# EAGLE board 8_bit_Left_Rev_A (EAGLE 9.6.0)
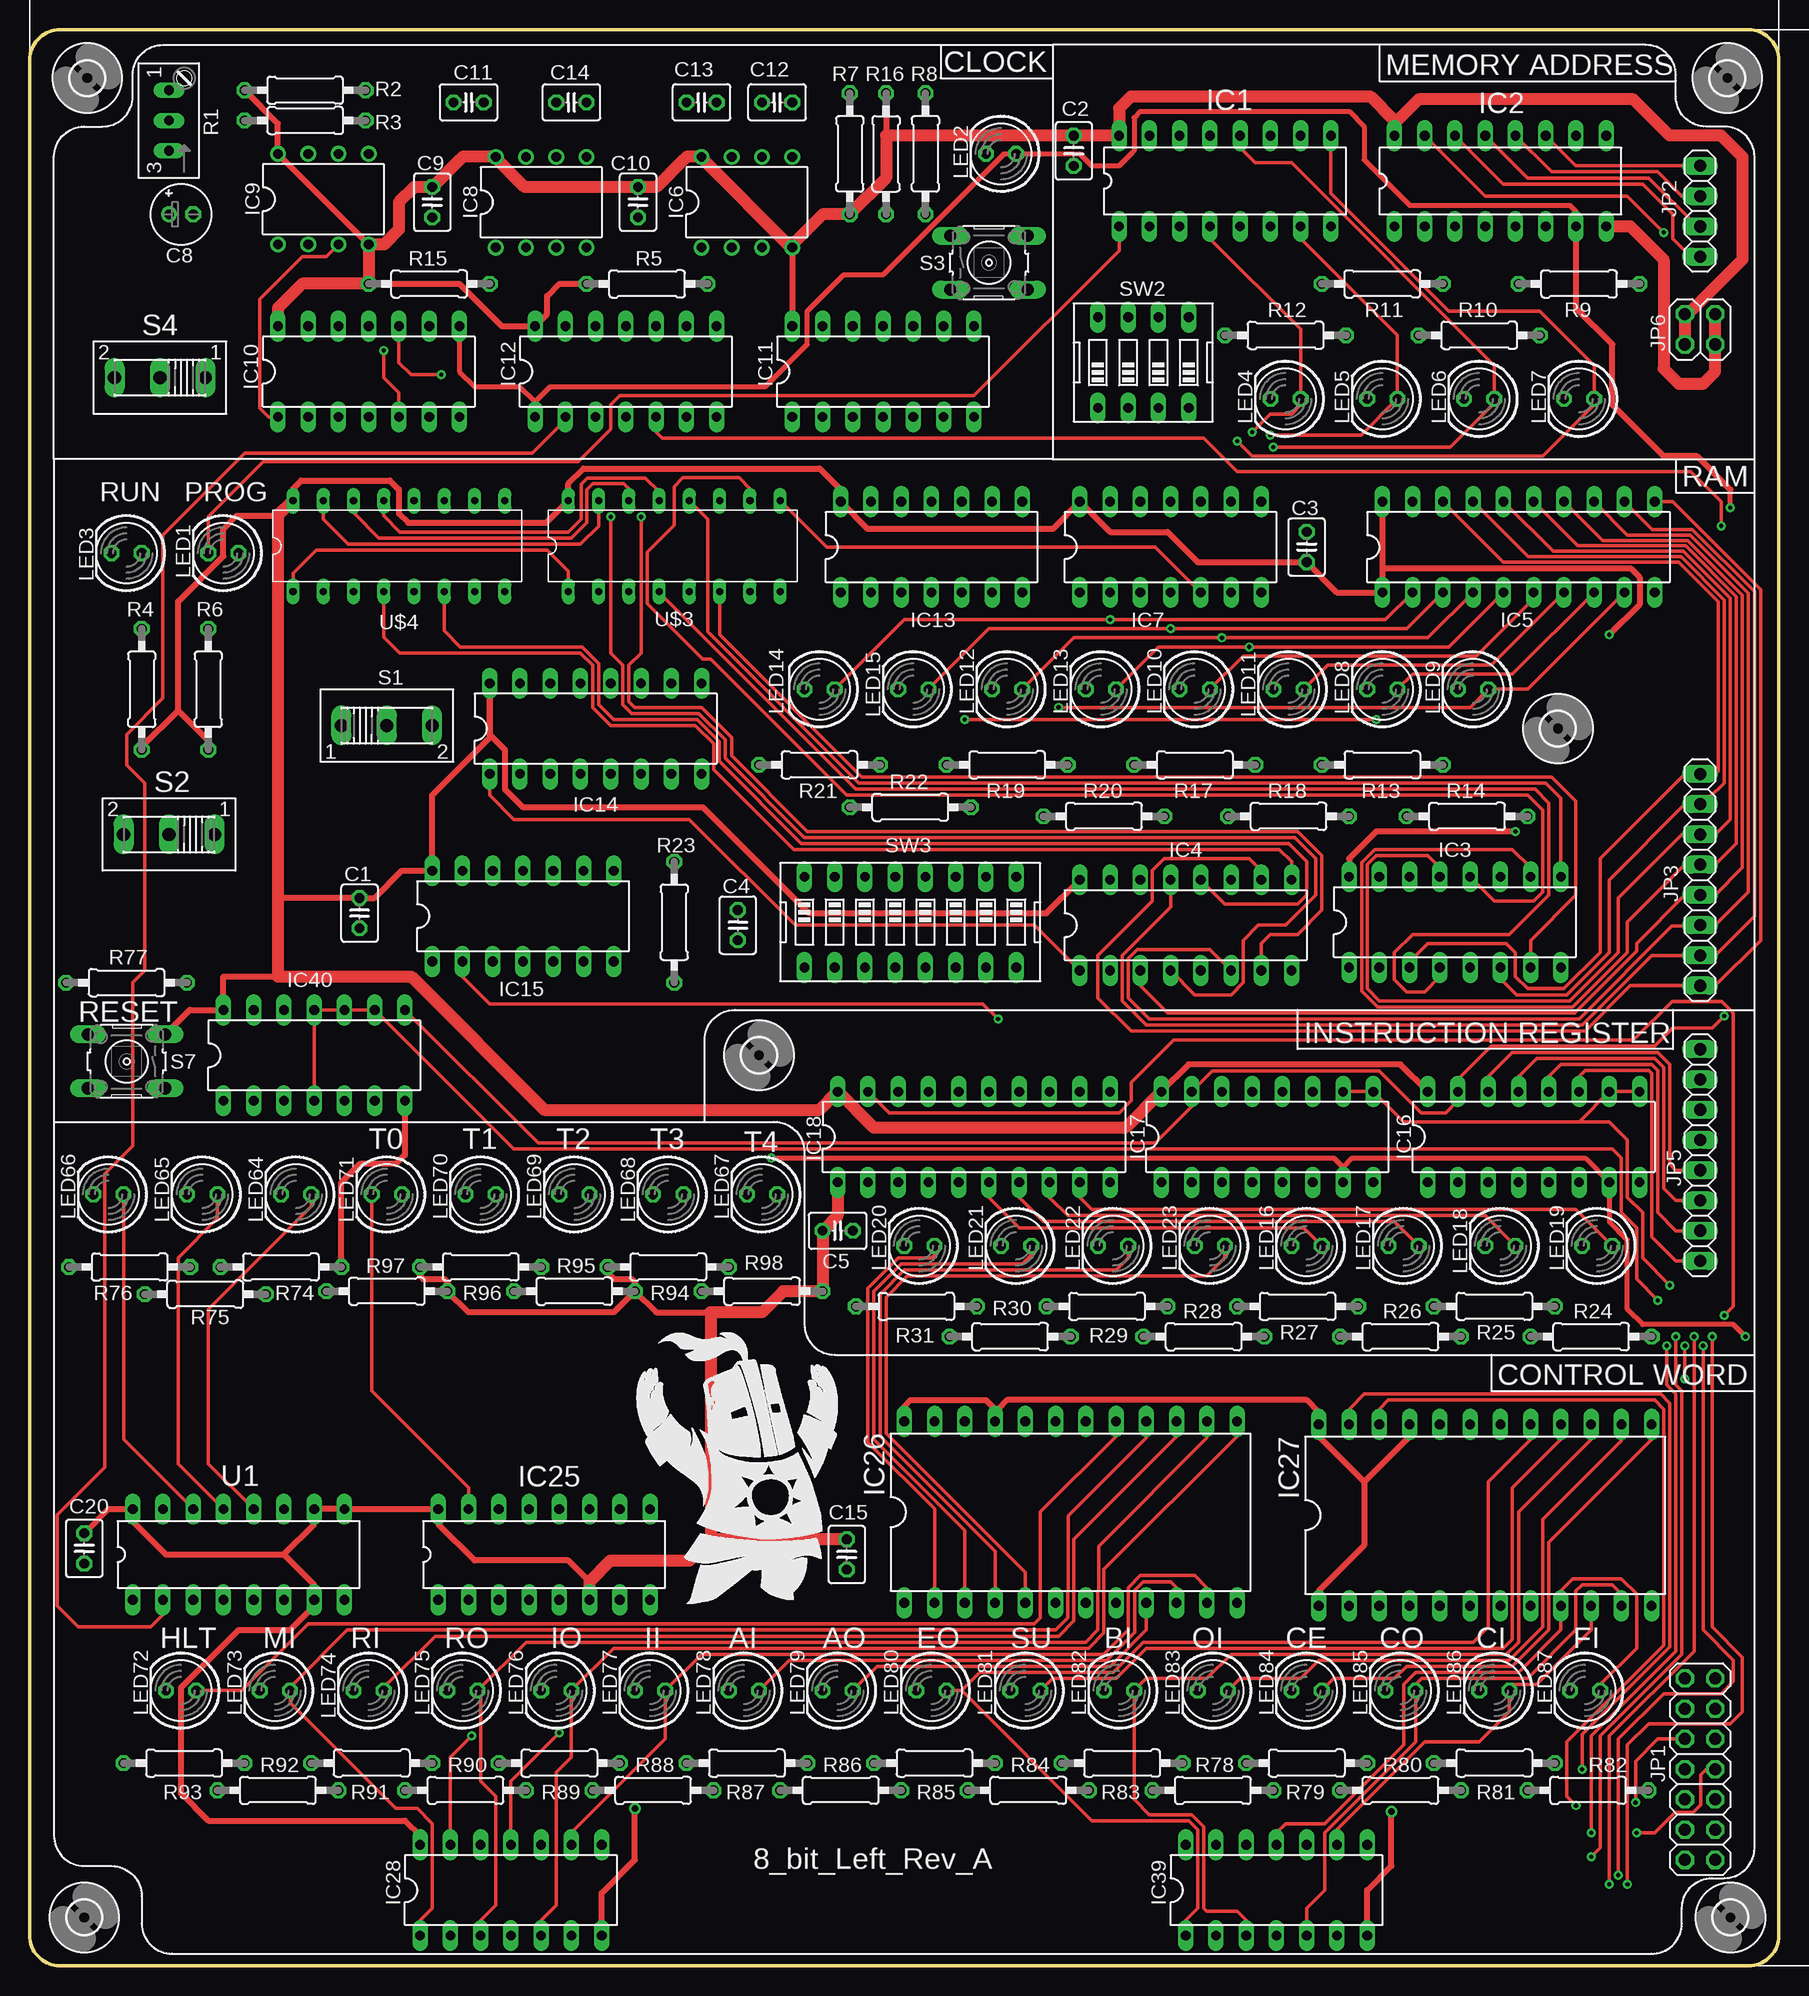
[diagram p6: board, top side]
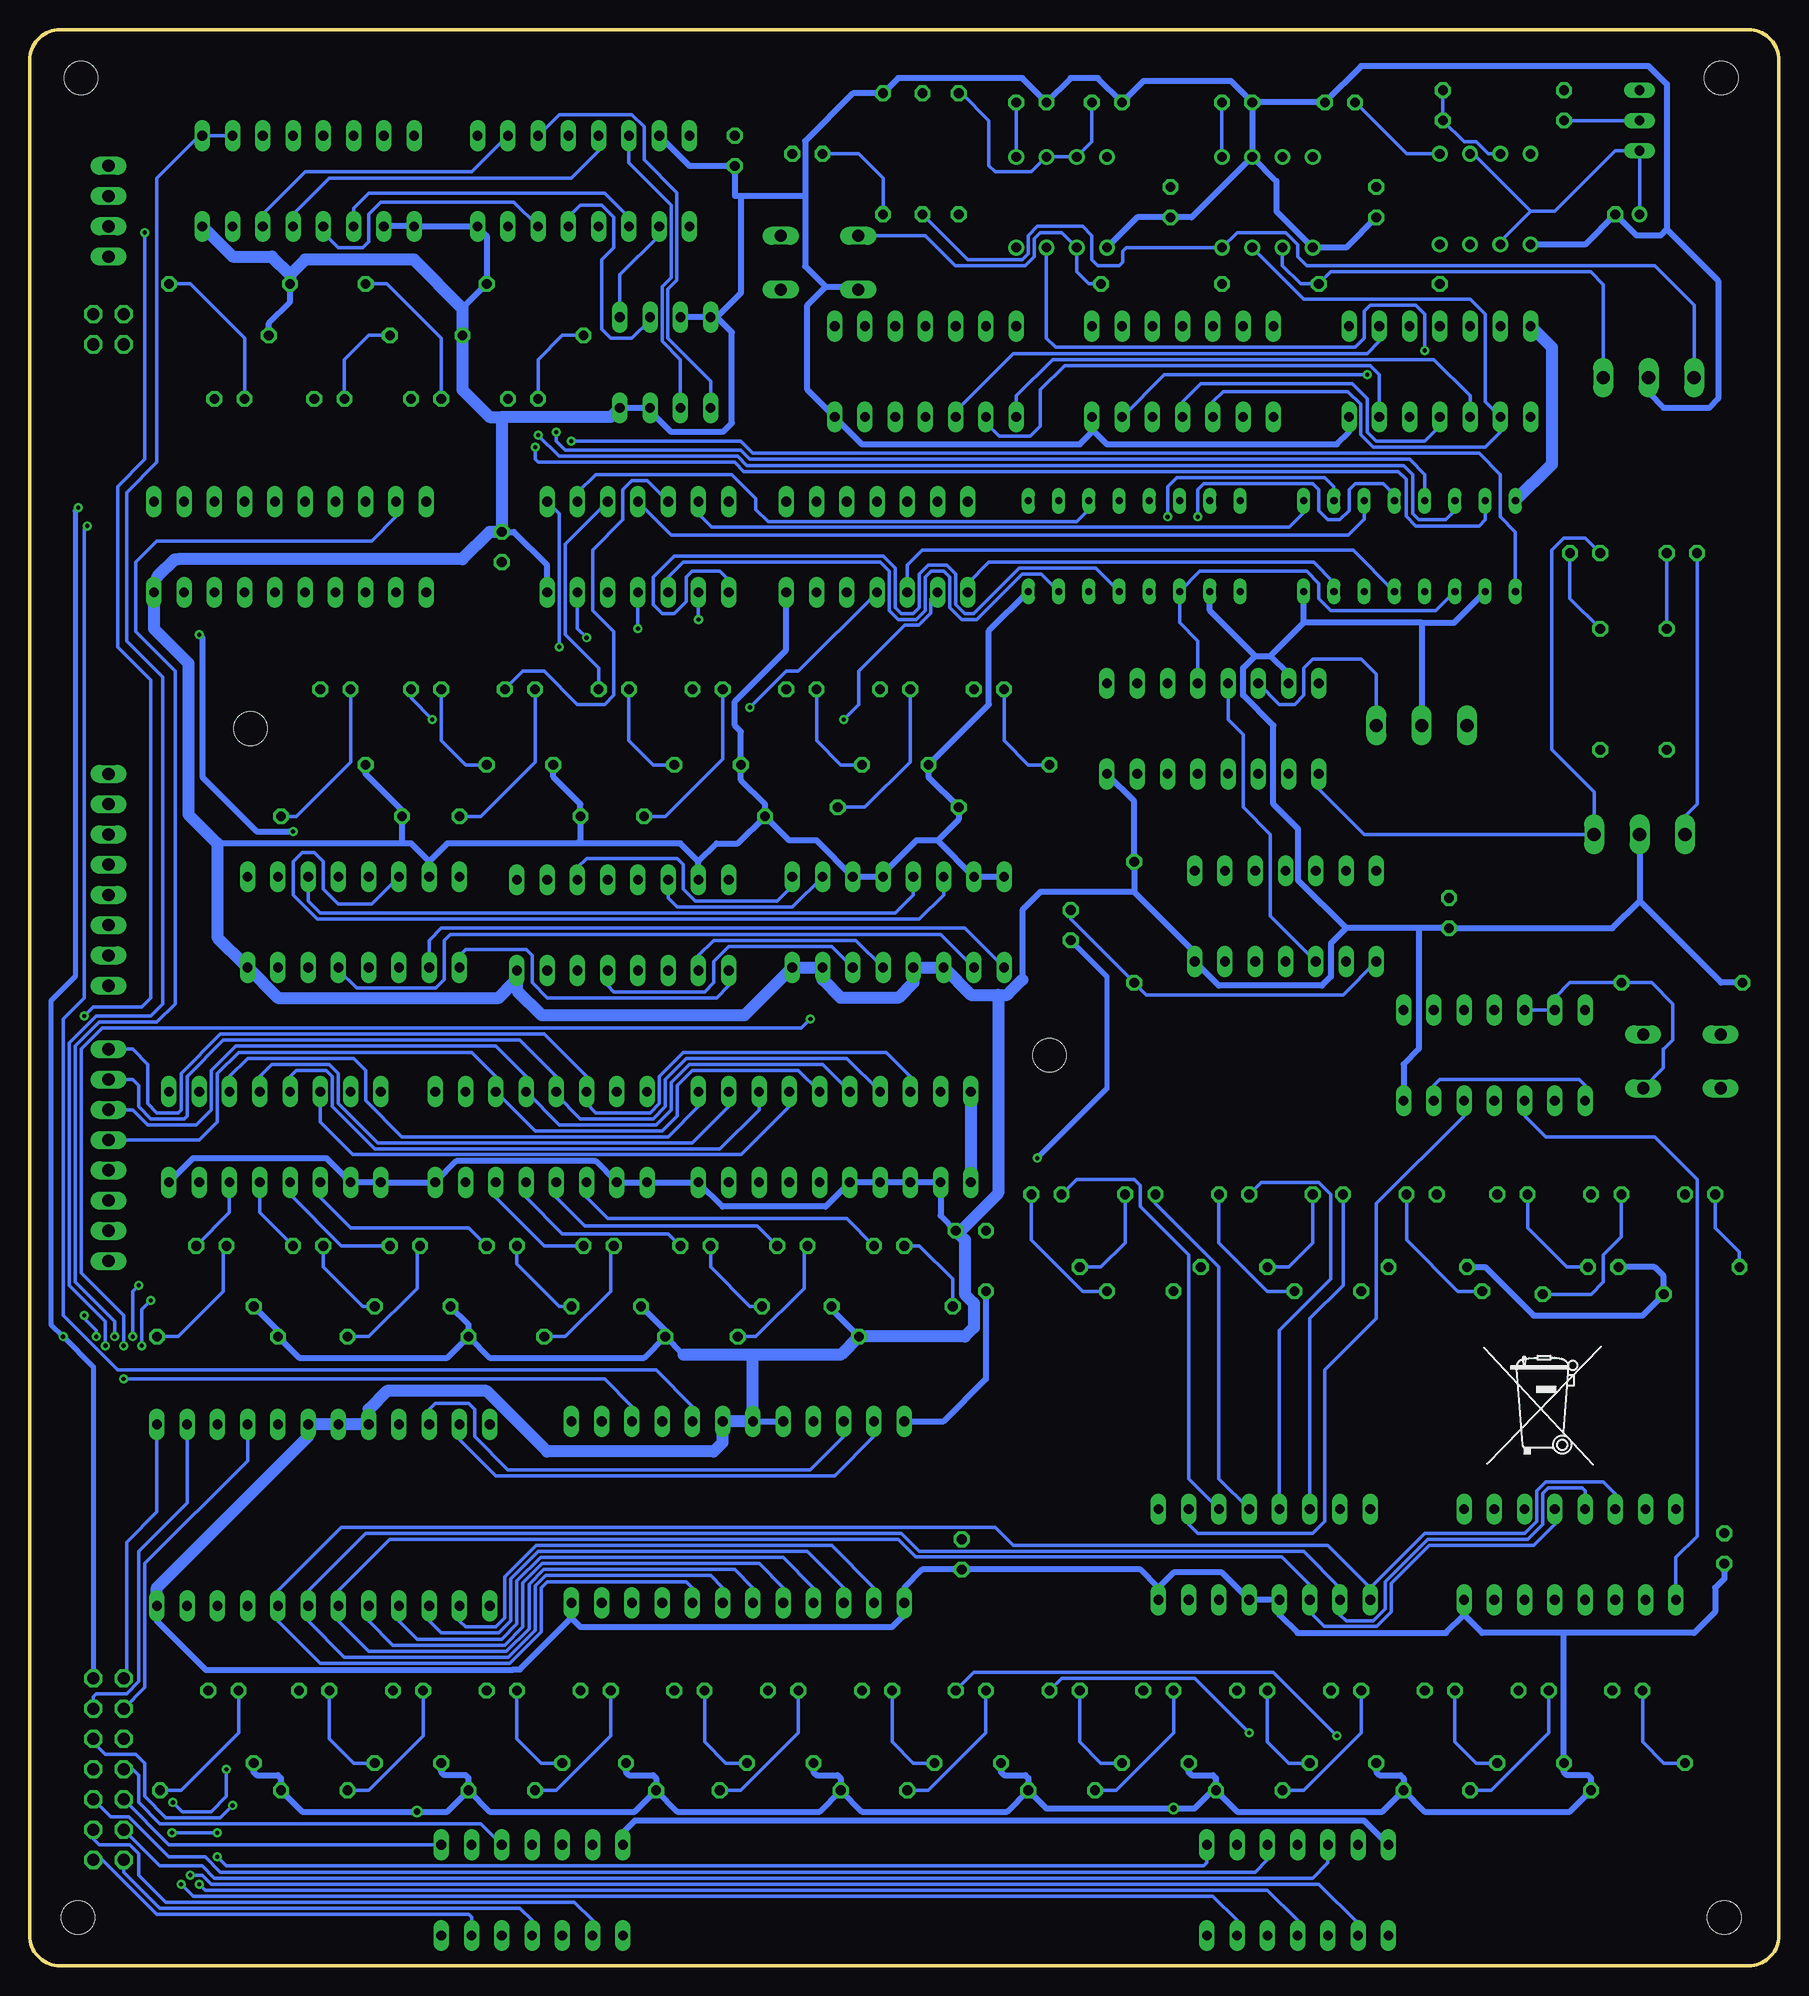
[diagram p7: board, bottom side, seen from below]

Size 146.81 x 162.56 mm. Coordinates in mm from the lower left corner, seen from the top.
Outline: 144.27,162.56 2.54,162.56 arc90 0,160.02 0,2.54 arc90 2.54,0 144.27,0 arc90 146.81,2.54 146.81,160.02 arc90 144.27,162.56
Copper layers (1*16): Top 0.035mm / dielectric 1.5mm / Bottom 0.035mm
Design rules "default": minimum track width 6mil, minimum drill 0.35mm, track to track 6mil, track to pad 6mil, pad to pad 6mil, via to via 6mil, smd to smd 6mil, copper to edge 40mil, drill to drill 6mil, minimum pad ring 10mil, minimum via ring 8mil, stop-mask expansion 4mil, vias tented up to drill 0mil, thermal gap 10mil
Net classes: 1 zasilanie: width 0.508 mm

## Footprints (pad centres in the part's own frame; a part is rotated, then mirrored left to right if it is on the bottom)
C025-030X050 = drill 0.813 octagon: 1 -1.27,0; 2 1.27,0
E2-5 = drill 0.813 pad 1.27: + -1.016,0 | drill 0.813 pad 1.27 octagon: - 1.016,0
2,8 = hole 2.8: 0,0
DIL16 = drill 0.813 long: 1 -8.89,-3.81; 2 -6.35,-3.81; 3 -3.81,-3.81; 4 -1.27,-3.81; 5 1.27,-3.81; 6 3.81,-3.81; 7 6.35,-3.81; 8 8.89,-3.81; 9 8.89,3.81; 10 6.35,3.81; 11 3.81,3.81; 12 1.27,3.81; 13 -1.27,3.81; 14 -3.81,3.81; 15 -6.35,3.81; 16 -8.89,3.81
DIL20 = drill 0.813 long: 1 -11.43,-3.81; 2 -8.89,-3.81; 3 -6.35,-3.81; 4 -3.81,-3.81; 5 -1.27,-3.81; 6 1.27,-3.81; 7 3.81,-3.81; 8 6.35,-3.81; 9 8.89,-3.81; 10 11.43,-3.81; 11 11.43,3.81; 12 8.89,3.81; 13 6.35,3.81; 14 3.81,3.81; 15 1.27,3.81; 16 -1.27,3.81; 17 -3.81,3.81; 18 -6.35,3.81; 19 -8.89,3.81; 20 -11.43,3.81
DIL08 = drill 0.813 pad 1.27: 1 -3.81,-3.81; 2 -1.27,-3.81; 3 1.27,-3.81; 4 3.81,-3.81; 5 3.81,3.81; 6 1.27,3.81; 7 -1.27,3.81; 8 -3.81,3.81
DIL14 = drill 0.813 long: 1 -7.62,-3.81; 2 -5.08,-3.81; 3 -2.54,-3.81; 4 0,-3.81; 5 2.54,-3.81; 6 5.08,-3.81; 7 7.62,-3.81; 8 7.62,3.81; 9 5.08,3.81; 10 2.54,3.81; 11 0,3.81; 12 -2.54,3.81; 13 -5.08,3.81; 14 -7.62,3.81
DIL24-6 = drill 0.813 long: 1 -13.97,-7.62; 2 -11.43,-7.62; 3 -8.89,-7.62; 4 -6.35,-7.62; 5 -3.81,-7.62; 6 -1.27,-7.62; 7 1.27,-7.62; 8 3.81,-7.62; 9 6.35,-7.62; 10 8.89,-7.62; 11 11.43,-7.62; 12 13.97,-7.62; 13 13.97,7.62; 14 11.43,7.62; 15 8.89,7.62; 16 6.35,7.62; 17 3.81,7.62; 18 1.27,7.62; 19 -1.27,7.62; 20 -3.81,7.62; 21 -6.35,7.62; 22 -8.89,7.62; 23 -11.43,7.62; 24 -13.97,7.62
2X07 = drill 1.016 octagon: 1 -7.62,-1.27; 2 -7.62,1.27; 3 -5.08,-1.27; 4 -5.08,1.27; 5 -2.54,-1.27; 6 -2.54,1.27; 7 0,-1.27; 8 0,1.27; 9 2.54,-1.27; 10 2.54,1.27; 11 5.08,-1.27; 12 5.08,1.27; 13 7.62,-1.27; 14 7.62,1.27
1X04 = drill 1.016 long: 1 -3.81,0; 2 -1.27,0; 3 1.27,0; 4 3.81,0
1X08 = drill 1.016 long: 1 -8.89,0; 2 -6.35,0; 3 -3.81,0; 4 -1.27,0; 5 1.27,0; 6 3.81,0; 7 6.35,0; 8 8.89,0
2X02 = drill 1.016 octagon: 1 -1.27,-1.27; 2 -1.27,1.27; 3 1.27,-1.27; 4 1.27,1.27
LED5MM = drill 0.813 octagon: A -1.27,0; K 1.27,0
S64W = drill 0.813 long: A 2.54,1.27; E -2.54,1.27; S 0,1.27
0207/10 = drill 0.813 octagon: 1 -5.08,0; 2 5.08,0
255SB = drill 1.118 long: 1 -3.81,0; 2 0,0; 3 3.81,0
B3F-10XX = drill 1.016 long: 1 -3.251,2.261; 2 3.251,2.261; 3 -3.251,-2.261; 4 3.251,-2.261
EDG-04 = drill 0.813 long: 1 -3.81,-3.81; 2 -1.27,-3.81; 3 1.27,-3.81; 4 3.81,-3.81; 5 3.81,3.81; 6 1.27,3.81; 7 -1.27,3.81; 8 -3.81,3.81
EDG-08 = drill 0.813 long: 1 -8.89,-3.81; 2 -6.35,-3.81; 3 -3.81,-3.81; 4 -1.27,-3.81; 5 1.27,-3.81; 6 3.81,-3.81; 7 6.35,-3.81; 8 8.89,-3.81; 9 8.89,3.81; 10 6.35,3.81; 11 3.81,3.81; 12 1.27,3.81; 13 -1.27,3.81; 14 -3.81,3.81; 15 -6.35,3.81; 16 -8.89,3.81
74LS189 = drill 0.6 long: 1 0,0.08; 2 2.54,0.08; 3 5.08,0.08; 4 7.62,0.08; 5 10.16,0.08; 6 12.7,0.08; 7 15.24,0.08; 8 17.78,0.08; 9 17.78,7.7; 10 15.24,7.7; 11 12.7,7.7; 12 10.16,7.7; 13 7.62,7.7; 14 5.08,7.7; 15 2.54,7.7; 16 0,7.7

## Placement (x,y rotation side)
C1  0,1uF  [C025-030X050]  27.69,88.39 270 top
C2  0,1uF  [C025-030X050]  87.63,152.4 270 top
C3  0,1uF  [C025-030X050]  107.19,119.13 90 top
C4  0,01uF  [C025-030X050]  59.44,87.38 90 top
C5  0,1uF  [C025-030X050]  67.82,61.72 0 top
C8  1uF  [E2-5]  12.7,147.07 0 top
C9  0,1uF  [C025-030X050]  33.78,148.08 270 top
C10  0,1uF  [C025-030X050]  51.05,148.08 270 top
C11  0,01uF  [C025-030X050]  36.83,156.46 0 top
C12  0,01uF  [C025-030X050]  62.74,156.46 180 top
C13  0,1uF  [C025-030X050]  56.39,156.46 180 top
C14  0,01uF  [C025-030X050]  45.47,156.46 180 top
C15  0,1uF  [C025-030X050]  68.58,34.54 270 top
C20  0,1uF  [C025-030X050]  4.57,35.05 270 top
H1  MOUNT-HOLE2.8  [2,8]  4.57,4.06 0 top
H2  MOUNT-HOLE2.8  [2,8]  4.83,158.5 0 top
H3  MOUNT-HOLE2.8  [2,8]  142.49,158.5 0 top
H4  MOUNT-HOLE2.8  [2,8]  142.75,4.06 0 top
H5  MOUNT-HOLE2.8  [2,8]  61.21,76.45 0 top
H6  MOUNT-HOLE2.8  [2,8]  128.27,103.89 0 top
IC1  74LS157N  [DIL16]  100.33,149.86 0 top
IC2  74LS173N  [DIL16]  123.44,149.86 0 top
IC3  74157N  [DIL16]  119.63,87.63 0 top
IC4  74157N  [DIL16]  97.03,87.38 0 top
IC5  74LS245N  [DIL20]  124.97,119.13 0 top
IC6  LM555N  [DIL08]  60.2,148.08 0 top
IC7  7404N  [DIL14]  95.76,119.13 0 top
IC8  LM555N  [DIL08]  42.93,148.08 0 top
IC9  LM555N  [DIL08]  24.64,148.34 0 top
IC10  74LS08N  [DIL14]  28.45,133.86 0 top
IC11  74LS32N  [DIL14]  71.63,133.86 0 top
IC12  74LS04N  [DIL14]  50.04,133.86 0 top
IC13  7404N  [DIL14]  75.69,119.13 0 top
IC14  74157N  [DIL16]  47.5,103.89 0 top
IC15  7400N  [DIL14]  41.4,88.14 0 top
IC16  74LS173N  [DIL16]  126.24,69.6 0 top
IC17  74LS173N  [DIL16]  103.89,69.6 0 top
IC18  74LS245N  [DIL20]  79.25,69.6 0 top
IC25  74LS138N  [DIL16]  43.18,34.54 0 top
IC26  28C16AP  [DIL24-6]  87.38,38.1 0 top
IC27  28C16AP  [DIL24-6]  122.17,37.85 0 top
IC28  7404N  [DIL14]  40.39,6.35 0 top
IC39  7404N  [DIL14]  104.65,6.35 0 top
IC40  7400N  [DIL14]  23.88,76.45 0 top
JP1  [2X07]  140.21,16.51 270 top
JP2  [1X04]  140.21,147.32 270 top
JP3  [1X08]  140.21,91.19 90 top
JP5  [1X08]  140.21,68.07 90 top
JP6  [2X02]  140.21,137.41 0 top
LED1  RED  [LED5MM]  16.26,118.62 180 top
LED2  BLUE  [LED5MM]  81.53,152.15 180 top
LED3  GREEN  [LED5MM]  8.13,118.62 180 top
LED4  YELLOW  [LED5MM]  105.41,131.57 180 top
LED5  YELLOW  [LED5MM]  113.54,131.57 180 top
LED6  YELLOW  [LED5MM]  121.67,131.57 180 top
LED7  YELLOW  [LED5MM]  130.05,131.57 180 top
LED8  RED  [LED5MM]  113.54,107.19 180 top
LED9  RED  [LED5MM]  121.16,107.19 180 top
LED10  RED  [LED5MM]  97.79,107.19 180 top
LED11  RED  [LED5MM]  105.66,107.19 180 top
LED12  RED  [LED5MM]  82.04,107.19 180 top
LED13  RED  [LED5MM]  89.92,107.19 180 top
LED14  RED  [LED5MM]  66.29,107.19 180 top
LED15  RED  [LED5MM]  74.17,107.19 180 top
LED16  YELLOW  [LED5MM]  107.19,60.45 180 top
LED17  YELLOW  [LED5MM]  115.32,60.45 180 top
LED18  YELLOW  [LED5MM]  123.44,60.45 180 top
LED19  YELLOW  [LED5MM]  131.57,60.45 180 top
LED20  BLUE  [LED5MM]  74.68,60.45 180 top
LED21  BLUE  [LED5MM]  82.8,60.45 180 top
LED22  BLUE  [LED5MM]  90.93,60.45 180 top
LED23  BLUE  [LED5MM]  99.06,60.45 180 top
LED64  RED  [LED5MM]  22.35,64.77 180 top
LED65  RED  [LED5MM]  14.48,64.77 180 top
LED66  RED  [LED5MM]  6.6,64.77 180 top
LED67  GREEN  [LED5MM]  61.47,64.77 180 top
LED68  GREEN  [LED5MM]  53.59,64.77 180 top
LED69  GREEN  [LED5MM]  45.72,64.77 180 top
LED70  GREEN  [LED5MM]  37.85,64.77 180 top
LED71  GREEN  [LED5MM]  29.97,64.77 180 top
LED72  BLUE  [LED5MM]  12.7,23.11 180 top
LED73  BLUE  [LED5MM]  20.57,23.11 180 top
LED74  BLUE  [LED5MM]  28.45,23.11 180 top
LED75  BLUE  [LED5MM]  36.32,23.11 180 top
LED76  BLUE  [LED5MM]  44.2,23.11 180 top
LED77  BLUE  [LED5MM]  52.07,23.11 180 top
LED78  BLUE  [LED5MM]  59.94,23.11 180 top
LED79  BLUE  [LED5MM]  67.82,23.11 180 top
LED80  BLUE  [LED5MM]  75.69,23.11 180 top
LED81  BLUE  [LED5MM]  83.57,23.11 180 top
LED82  BLUE  [LED5MM]  91.44,23.11 180 top
LED83  BLUE  [LED5MM]  99.31,23.11 180 top
LED84  BLUE  [LED5MM]  107.19,23.11 180 top
LED85  BLUE  [LED5MM]  115.06,23.11 180 top
LED86  BLUE  [LED5MM]  122.94,23.11 180 top
LED87  BLUE  [LED5MM]  130.56,23.11 180 top
R1  1M  [S64W]  12.95,154.94 90 top
R2  1k  [0207/10]  23.11,157.48 180 top
R3  1k  [0207/10]  23.11,154.94 180 top
R4  1k  [0207/10]  9.4,107.19 90 top
R5  1k  [0207/10]  51.82,141.22 0 top
R6  1k  [0207/10]  14.99,107.19 90 top
R7  1M  [0207/10]  68.83,152.15 90 top
R8  1k  [0207/10]  71.88,152.15 270 top
R9  220  [0207/10]  130.05,141.22 0 top
R10  220  [0207/10]  121.67,136.91 180 top
R11  220  [0207/10]  113.54,141.22 0 top
R12  220  [0207/10]  105.41,136.91 180 top
R13  220  [0207/10]  113.54,100.84 180 top
R14  220  [0207/10]  120.65,96.52 0 top
R15  1k  [0207/10]  33.53,141.22 0 top
R16  220  [0207/10]  75.18,152.15 90 top
R17  220  [0207/10]  97.79,100.84 180 top
R18  220  [0207/10]  105.66,96.52 0 top
R19  220  [0207/10]  82.04,100.84 180 top
R20  220  [0207/10]  90.17,96.52 0 top
R21  220  [0207/10]  66.29,100.84 180 top
R22  220  [0207/10]  73.91,97.28 0 top
R23  1k  [0207/10]  54.1,87.63 270 top
R24  220  [0207/10]  131.06,52.83 0 top
R25  220  [0207/10]  122.94,55.37 180 top
R26  220  [0207/10]  115.06,52.83 0 top
R27  220  [0207/10]  106.43,55.37 180 top
R28  220  [0207/10]  98.55,52.83 0 top
R29  220  [0207/10]  90.42,55.37 180 top
R30  220  [0207/10]  82.3,52.83 0 top
R31  220  [0207/10]  74.42,55.37 180 top
R74  220  [0207/10]  21.08,58.67 180 top
R75  220  [0207/10]  14.73,56.39 0 top
R76  220  [0207/10]  8.38,58.67 180 top
R77  1k  [0207/10]  8.13,82.55 180 top
R78  220  [0207/10]  99.31,14.73 0 top
R79  220  [0207/10]  107.19,17.02 180 top
R80  220  [0207/10]  115.06,14.73 0 top
R81  220  [0207/10]  122.94,17.02 180 top
R82  220  [0207/10]  130.81,14.73 0 top
R83  220  [0207/10]  91.69,17.02 180 top
R84  220  [0207/10]  83.82,14.73 0 top
R85  220  [0207/10]  75.95,17.02 180 top
R86  220  [0207/10]  68.07,14.73 0 top
R87  220  [0207/10]  60.2,17.02 180 top
R88  220  [0207/10]  52.32,14.73 0 top
R89  220  [0207/10]  44.45,17.02 180 top
R90  220  [0207/10]  36.58,14.73 0 top
R91  220  [0207/10]  28.7,17.02 180 top
R92  220  [0207/10]  20.83,14.73 0 top
R93  220  [0207/10]  12.95,17.02 180 top
R94  220  [0207/10]  53.59,58.67 180 top
R95  220  [0207/10]  45.72,56.64 0 top
R96  220  [0207/10]  37.85,58.67 180 top
R97  220  [0207/10]  29.97,56.64 0 top
R98  220  [0207/10]  61.47,56.64 0 top
S1  5 mm  [255SB]  29.97,104.14 0 top
S2  5 mm  [255SB]  11.68,95 180 top
S3  5mm  [B3F-10XX]  80.52,143 0 top
S4  5 mm  [255SB]  10.92,133.35 180 top
S7  RESET  [B3F-10XX]  8.13,75.95 180 top
SW2  [EDG-04]  93.47,134.62 0 top
SW3  [EDG-08]  73.91,87.63 180 top
U1  74LS161N  [DIL16]  17.53,34.54 0 top
U$1  [MUELLTONNE_10.00]  25.4,41.66 0 bottom
U$2  [SOLAIRE]  47.5,28.19 0 top
U$3  74LS189A  [74LS189]  45.21,115.32 0 top
U$4  74LS189A  [74LS189]  22.1,115.32 0 top

## Tracks (layer width: path | path; a pad name or v marks a point on that pad's centre or on a via)
A0  (via drill 0.35)
  Top 0.305: IC1.9 109.22,148.84 119.13,138.94 126.75,138.94 131.32,134.37 LED7.A 131.32,131.06 127,126.75 102.62,126.75 v101.35,128.02 | U$4.1 22.1,116.92 24.05,118.87 43.43,118.87 45.21,117.09 U$3.1
  Bottom 0.305: U$4.1 22.1,120.4 23.37,121.67 23.37,125.22 25.15,127 86.11,127 87.12,128.02 v101.35,128.02
A1  (via drill 0.35)
  Top 0.305: IC1.12 101.6,152.65 102.87,151.38 105.92,151.38 122.94,134.37 LED6.A 122.94,131.22 119.22,127.51 v104.37,127.51 | U$4.15 24.64,121.49 26.75,119.38 46.23,119.38 47.75,120.9 U$3.15
  Bottom 0.305: U$4.15 24.64,121.41 25.15,120.9 30.48,120.9 31.29,121.71 31.29,124.83 31.93,125.48 86.87,125.48 87.64,126.25 104.13,126.25 104.37,126.49 v104.37,127.51
A2  (via drill 0.35)
  Top 0.305: IC1.7 106.68,145.03 114.81,136.91 LED5.A 111.76,128.52 v104.12,128.52 | U$4.14 27.18,122 29.29,119.89 45.47,119.89 46.74,121.16 46.74,123.95 47.24,124.46 49.86,124.46 50.29,124.03 U$3.14
  Bottom 0.305: U$4.14 27.18,122.17 27.94,121.41 30.23,121.41 30.73,121.92 30.73,125.22 31.5,125.98 86.61,125.98 87.38,126.75 102.36,126.75 104.12,128.5 v104.12,128.52
A3  (via drill 0.35)
  Top 0.305: IC1.4 99.06,145.03 106.68,137.41 LED4.A 106.68,131.06 105.92,130.3 104.14,130.3 v102.62,128.78 | U$4.13 29.72,121.75 31.07,120.4 45.21,120.4 46.28,121.46 46.28,124.39 46.8,124.92 51.68,124.92 52.83,123.77 U$3.13
  Bottom 0.305: U$4.13 29.72,125.22 30.99,126.49 86.36,126.49 87.12,127.25 101.85,127.25 102.62,128.02 v102.62,128.78
ASD1
  Bottom 0.305: IC25.10 49.53,37.08 48.77,36.32 39.12,36.32 38.1,37.34 38.1,50.04 33.78,54.36 33.78,64.01 26.42,71.37 IC40.5
CE
  Top 0.305: LED84.A 109.47,24.13 114.55,24.13 115.57,25.15 124.46,25.15 127.51,28.19 127.51,35.56 136.14,44.2 IC27.13
  Bottom 0.305: IC27.13 136.14,38.1 138.68,35.56 138.68,24.38 JP1.1
CF  (via drill 0.35)
  Top 0.305: IC27.23 110.74,46.74 112.01,48.01 136.91,48.01 137.67,47.24 137.67,26.79 130.3,19.42 v130.3,16.51 | v134.79,13.72 134.79,17.19 136.65,19.05 JP1.5
  Bottom 0.305: IC27.23 110.74,44.2 107.7,41.15 79.25,41.15 75.95,44.45 IC26.23 | v130.3,16.51 130.3,14.22 131.57,12.95 134.03,12.95 v134.79,13.72
CLK  (via drill 0.35)
  Top 0.305: 92.58,152.27 92.71,152.4
  Top 0.406: IC10.8 36.07,133.86 37.34,132.59 41.15,132.59 42.42,131.32 | IC12.1 42.42,131.32 | 42.42,131.32 43.69,132.59 61.72,132.59 65.28,136.14 65.28,138.94 68.33,141.99 71.63,141.99 81.79,152.15 LED2.A 88.14,152.15 89.15,151.13 91.44,151.13 92.58,152.27 | 92.71,152.4 92.71,155.19 93.22,155.7 110.74,155.7 112.01,154.43 112.01,151.64 115.82,147.83 129.29,147.83 129.79,147.32 IC2.7 | v62.23,67.82 109.47,67.82 110.24,67.06 | IC17.7 110.24,67.06 | 110.24,67.06 111,67.82 130.56,67.82 IC16.7 132.59,62.48 134.11,60.96 134.11,55.12 135.38,53.85 143,53.85 v144.02,52.83 | v142.75,122.43 142.75,123.95
  Top 0.508: 142.75,123.95 139.95,126.75 137.16,126.75 132.84,131.06 132.84,136.14 129.79,139.19 IC2.7
  Bottom 0.406: C4.1 56.39,83.06 56.39,73.66 v62.23,67.82 | v142.75,122.43 143,122.17 143,83.06 145.03,81.03 145.03,53.85 v144.02,52.83 141.48,50.29 JP1.2
CLK4
  Top 0.305: U1.14 7.87,44.2 LED66.A
  Bottom 0.305: IC26.8 91.19,31.75 91.69,32.26 103.38,32.26 103.89,31.75 103.89,28.03 106.52,25.4 122.43,25.4 125.98,28.96 IC27.8 125.98,31.5 120.65,36.83 65.79,36.83 64.26,35.31 37.85,35.31 34.29,31.75 | IC25.1 34.29,31.75 | U1.14 13.72,39.62 14.73,40.64 19.56,40.64 20.32,39.88 20.32,37.34 21.34,36.32 29.72,36.32 34.29,31.75
CLK5
  Top 0.305: U1.13 12.45,42.16 12.45,59.44 15.75,62.74 LED65.A
  Bottom 0.305: IC26.7 88.65,31.75 89.66,32.77 103.52,32.77 104.39,31.89 104.39,28.17 106.66,25.91 120.4,25.91 123.44,28.96 IC27.7 123.44,31.5 118.62,36.32 73.66,36.32 72.14,34.8 39.88,34.8 36.83,31.75 IC25.2 36.83,29.46 36.32,28.96 34.04,28.96 33.02,29.97 33.02,32.26 29.46,35.81 21.08,35.81 19.81,37.08 19.81,39.67 19.36,40.13 16.51,40.13 16.26,39.88 U1.13
CLK6
  Top 0.305: U1.12 14.99,42.16 14.99,55.12 23.62,63.75 LED64.A
  Bottom 0.305: IC26.6 86.11,31.75 87.63,33.27 103.66,33.27 104.9,32.03 104.9,28.31 106.8,26.42 118.36,26.42 120.9,28.96 IC27.6 120.9,31.5 116.59,35.81 73.91,35.81 72.44,34.34 41.71,34.34 39.37,32 IC25.3 39.37,29.72 38.15,28.5 33.73,28.5 32.51,29.72 32.51,32.12 29.32,35.31 20.57,35.31 18.8,37.08 U1.12
CLR  (via drill 0.35)
  Top 0.305: IC2.15 122.17,148.59 134.11,148.59 v137.16,145.54 | v142.24,79.76 141.22,78.74 137.92,78.74 136.4,77.22 122.68,77.22 119.89,74.42 IC16.15 119.89,72.64 118.87,71.63 116.79,71.63 113.28,75.13 99.26,75.13 IC17.15 97.54,72.14 94.49,69.09 42.67,69.09 IC40.8
  Bottom 0.305: v142.24,79.76 141.48,80.52 137.41,80.52 136.65,81.28 136.65,107.95 139.45,110.74 139.45,124.21 137.16,126.49 v137.16,145.54
GND  (via drill 0.55)
  Top 0.508: v114.3,12.95 114.3,8.38 112.27,6.35 IC39.7 | IC28.7 48.01,6.1 50.8,8.89 v50.8,13.21 | R74.1 26.16,65.79 27.69,67.31 30.73,67.31 31.5,68.07 IC40.7
  Top 1.016: IC2.8 134.37,146.05 137.16,143.26 137.16,134.11 138.43,132.84 140.46,132.84 141.48,133.86 JP6.3 JP6.4
  Bottom 0.508: C9.2 36.32,144.27 IC8.1 42.16,147.32 42.16,149.86 IC8.6 | C14.2 C11.2 35.05,159.51 10.92,159.51 9.4,157.99 9.4,145.8 | C14.2 IC8.6 | IC8.6 49.28,146.81 C10.2 53.85,146.81 IC6.1 | C14.2 45.97,158.24 53.34,158.24 C13.2 57.15,158.5 59.44,158.5 C12.2 63.5,158.5 73.91,158.5 R16.2 77.72,157.23 81.74,153.21 81.74,148.59 | IC9.1 16.26,144.53 C8.- 11.94,145.29 9.91,145.29 9.4,145.8 | IC10.7 36.07,128.78 37.08,127.76 56.39,127.76 57.66,129.03 IC12.7 57.66,128.78 58.67,127.76 76.96,127.76 IC11.7 81.53,132.33 81.53,139.45 80.01,140.97 | 110.49,139.19 R11.1 108.46,145.29 IC1.8 IC2.1 IC2.2 | R10.1 126.75,137.92 124.97,139.7 R9.1 | 124.71,142.24 124.97,141.99 | 114.55,143.26 114.81,143.26 | SW2.7 SW2.8 89.15,138.43 | SW2.3 95,130.81 | 95,130.81 SW2.4 | 95,130.81 92.96,128.78 88.65,128.78 87.88,129.54 87.88,137.16 89.15,138.43 | 89.15,138.43 87.12,140.46 87.12,148.59 | R20.1 85.09,97.54 87.12,99.57 R19.1 87.12,103.63 87.63,104.14 87.63,106.17 83.31,110.49 IC13.7 | R17.1 102.87,99.82 100.58,97.54 R18.1 100.58,94.49 100.84,94.23 | R13.1 118.62,100.08 115.57,97.03 R14.1 115.57,94.23 | 70.61,94.49 68.83,96.27 R22.1 71.37,99.82 R21.1 66.29,105.92 66.29,112.09 U$3.8 | R20.1 83.06,94.49 80.77,94.49 SW3.3 SW3.4 75.18,91.69 72.39,94.49 70.61,94.49 | R20.1 87.38,94.23 89.15,94.23 90.68,92.71 | 54.1,90.17 49.02,85.09 IC15.7 46.99,82.3 38.35,82.3 37.59,83.06 37.59,85.85 36.32,87.12 | 30.23,87.12 C1.2 13.97,87.12 11.68,89.41 | 30.23,87.12 36.32,87.12 | SW3.8 SW3.7 70.61,94.49 | 106.17,82.55 105.92,82.8 | IC14.8 54.1,97.79 R23.1 54.1,90.17 | 43.94,109.98 44.96,108.97 44.96,106.68 42.42,104.14 42.42,97.54 40.34,95.45 40.34,91.14 36.32,87.12
  Bottom 0.508: 43.94,109.98 42.67,109.98 | 42.67,109.98 41.15,108.46 IC14.15 | 42.67,109.98 39.88,112.78 | 39.88,112.78 U$4.8 | 43.94,109.98 47.75,113.79 U$3.2 | 128.78,84.07 IC3.8 | IC3.15 113.28,92.71 | 113.28,92.71 114.81,94.23 115.57,94.23 | 113.28,92.71 111.76,94.23 100.84,94.23 | IC4.15 90.68,92.71 | 90.68,92.71 92.2,94.23 100.84,94.23 | C3.2 106.17,120.4 103.38,117.6 IC7.7 | 54.1,90.17 61.98,90.17 63.5,88.65 63.5,82.8 | 64.39,81.92 64.26,82.04 | 115.57,94.23 131.06,94.23 | 136.14,116.59 136.4,116.33 IC5.10 | 134.37,118.11 134.62,118.11 | R25.1 125.98,53.34 R24.1 124.21,51.05 111.76,51.05 R26.1 | R26.1 109.98,53.85 R27.1 | R26.1 108.2,51.05 95.25,51.05 R28.1 | R28.1 93.47,53.34 R29.1 | 91.95,51.31 R28.1 | IC16.8 133.1,67.82 121.92,67.82 IC16.2 IC16.1 IC17.8 111,67.56 99.31,67.56 IC17.2 IC17.1 IC18.10 88.65,63.75 80.01,63.75 IC18.5 IC18.4 IC18.3 IC18.2 70.36,62.99 C5.2 | R30.1 79.5,55.12 R31.1 | R74.1 24.64,58.67 20.57,54.61 11.43,54.61 R75.1 9.65,57.91 10.41,58.67 R76.1 | R81.1 128.02,16.26 127.76,16 125.98,16 125.73,15.75 R82.1 123.95,12.95 v114.3,12.95 111.76,12.95 R80.1 | R80.1 109.98,15.75 110.24,16 112.01,16 112.27,16.26 R79.1 | R80.1 108.2,12.95 96.01,12.95 R78.1 | R78.1 92.46,12.95 80.52,12.95 R84.1 | R84.1 76.96,12.95 64.77,12.95 R86.1 | R86.1 61.47,13.21 v50.8,13.21 49.02,13.21 47.5,14.73 R88.1 | R88.1 45.47,12.95 33.27,12.95 R90.1 | R90.1 29.72,12.95 17.53,12.95 R92.1 15.75,15.75 16,16 17.78,16 18.03,16.26 R93.1 18.03,27.94 | R91.1 33.78,16.26 33.53,16 31.75,16 31.5,15.75 R90.1 | R89.1 49.53,16.26 49.28,16 47.5,16 47.24,15.75 R88.1 | R87.1 65.28,16.26 65.02,16 63.25,16 62.99,15.75 R86.1
  Bottom 0.508: R85.1 81.03,16.26 80.77,16 78.99,16 78.74,15.75 R84.1 | R78.1 94.23,15.75 94.49,16 96.52,16 96.77,16.26 R83.1 | C20.2 4.57,32.51 5.33,31.75 5.33,29.72 7.11,27.94 18.03,27.94 | IC26.19 IC26.20 | 101.35,29.21 100.58,28.45 74.42,28.45 73.41,29.46 IC26.1 73.41,31.75 71.88,33.27 C15.2 53.59,33.27 52.07,31.75 | IC26.12 101.35,29.21 | IC25.8 52.07,31.75 | 52.07,31.75 50.8,33.02 46.74,33.02 IC25.5 IC25.4 41.91,29.46 40.39,27.94 27.94,27.94 26.42,29.46 | 26.42,29.46 24.89,27.94 18.03,27.94 | 26.42,29.46 U1.8 | IC27.12 136.14,28.96 132.03,24.84 106.29,24.84 106.24,24.89 105.66,24.89 101.35,29.21 | R77.2 4.83,82.55 11.68,89.41 | IC1.15 91.44,151.13 C2.2 87.63,148.59 87.12,148.59 | 30.23,87.12 30.23,76.96 31.5,75.69 IC40.7 | 29.97,112.78 27.26,112.78 U$4.2 | 29.97,112.78 39.88,112.78 | S4.2 10.92,132.08 9.65,130.81 5.84,130.81 5.08,131.57 5.08,141.48 9.4,145.8 | 81.74,148.59 87.12,148.59 | S2.2 11.68,89.41 | 29.97,112.78 S1.2 | 81.74,148.59 81.74,142.7 80.01,140.97 | 80.01,140.97 77.5,140.97 S3.3
  Bottom 1.016: IC2.8 129.79,143.51 126.49,143.51 124.97,141.99 R9.1 | 114.55,143.26 110.49,139.19 R12.1 110.49,132.33 108.2,130.05 107.19,130.05 | 114.81,143.26 123.7,143.26 124.71,142.24 | 107.19,130.05 98.04,130.05 SW2.4 | 107.19,130.05 C3.2 108.2,120.4 110.49,118.11 134.37,118.11 | 134.62,118.11 136.14,116.59 | IC5.10 136.4,112.27 133.5,109.37 133.5,96.67 131.06,94.23 131.06,86.36 128.78,84.07 | IC3.8 125.98,81.28 107.44,81.28 106.17,82.55 | IC4.8 105.92,82.8 105.92,81.91 103.83,79.82 86.81,79.82 SW3.16 SW3.15 80.26,82.8 78.74,81.28 73.91,81.28 72.64,82.55 SW3.12 SW3.11 67.82,81.53 65.53,81.53 | 65.53,81.53 64.77,81.53 64.39,81.92 | 63.5,82.8 64.26,82.04 | 65.53,81.53 65.53,64.86 68.67,61.72 C5.2 68.33,60.96 68.33,56.39 67.56,55.63 67.56,53.59 68.33,52.83 R30.1 78.74,51.31 86.11,51.31 | 86.11,51.31 91.95,51.31 | 86.11,51.31 IC26.19 IC26.18 88.65,43.94 89.41,43.18 103.39,43.18 108.47,48.26 116.84,48.26 118.36,46.74 IC27.20 IC27.19 IC27.18 123.44,44.45 136.14,31.75 IC27.12
GND1
  Bottom 0.305: R9.2 133.35,141.22 128.78,136.65 LED7.K
GND2
  Bottom 0.305: R10.2 118.36,136.91 120.4,134.87 LED6.K
GND3
  Bottom 0.305: R11.2 116.84,141.22 112.27,136.65 LED5.K
GND4
  Bottom 0.305: R12.2 102.11,136.91 104.14,134.87 LED4.K
GND5
  Bottom 0.305: R13.2 110.24,100.84 112.27,102.87 LED8.K
GND6
  Bottom 0.305: R14.2 124.46,96.52 119.89,101.09 LED9.K
GND7
  Bottom 0.305: R17.2 94.49,100.84 96.52,102.87 LED10.K
GND8
  Bottom 0.305: R18.2 108.97,96.52 104.39,101.09 LED11.K
GND9
  Bottom 0.305: R19.2 78.74,100.84 80.77,102.87 LED12.K
GND10
  Bottom 0.305: R20.2 93.47,96.52 88.65,101.35 LED13.K
GND11
  Bottom 0.305: R21.2 62.99,100.84 65.02,102.87 LED14.K
GND12
  Bottom 0.305: R22.2 76.71,97.28 72.9,101.09 LED15.K
GND15
  Bottom 0.305: R24.2 134.37,52.83 130.56,56.64 130.56,60.2 LED19.K
GND16
  Bottom 0.305: R25.2 118.87,55.37 122.17,58.67 LED18.K
GND17
  Bottom 0.305: R26.2 118.36,52.83 114.3,56.9 114.3,60.2 LED17.K
GND18
  Bottom 0.305: R27.2 102.36,55.37 105.92,58.93 LED16.K
GND19
  Bottom 0.305: R28.2 101.85,52.83 98.04,56.64 98.04,60.2 LED23.K
GND20
  Bottom 0.305: R29.2 86.36,55.37 89.66,58.67 LED22.K
GND21
  Bottom 0.305: R30.2 85.85,52.83 81.79,56.9 81.79,60.2 LED21.K
GND22
  Bottom 0.305: LED20.K 72.14,60.45 69.34,57.66 R31.2
GND61
  Bottom 0.305: R74.2 17.78,58.67 21.08,61.98 LED64.K
GND62
  Bottom 0.305: R75.2 15.75,56.39 14.73,57.4 14.73,59.69 13.21,61.21 LED65.K
GND63
  Bottom 0.305: R76.2 3.3,59.94 5.33,61.98 LED66.K
GND64
  Bottom 0.305: IC25.12 46.99,40.89 46.99,58.67 52.32,64.01 LED68.K
GND65
  Bottom 0.305: IC25.13 41.91,53.34 37.59,57.66 37.59,64.77 38.61,65.79 43.43,65.79 LED69.K
GND66
  Bottom 0.305: LED70.K 36.58,57.15 39.37,54.36 IC25.14
GND67
  Top 0.305: LED71.K 28.7,48.26 36.83,40.13 IC25.15
GND68
  Bottom 0.305: IC25.11 49.53,40.89 49.53,59.69 53.59,63.75 53.59,65.53 54.1,66.04 58.93,66.04 LED67.K
GND69
  Bottom 0.305: R78.2 102.62,14.73 98.04,19.3 LED83.K
GND70
  Bottom 0.305: R79.2 103.89,17.02 105.92,19.05 LED84.K
GND71
  Bottom 0.305: R80.2 118.36,14.73 113.79,19.3 LED85.K
GND72
  Bottom 0.305: R81.2 119.63,17.02 121.67,19.05 LED86.K
GND73
  Bottom 0.305: R82.2 134.11,14.73 129.29,19.56 LED87.K
GND74
  Bottom 0.305: R83.2 88.39,17.02 90.17,18.8 LED82.K
GND75
  Bottom 0.305: R84.2 87.12,14.73 82.3,19.56 LED81.K
GND76
  Bottom 0.305: R85.2 72.64,17.02 74.42,18.8 LED80.K
GND77
  Bottom 0.305: R86.2 71.37,14.73 66.55,19.56 LED79.K
GND78
  Bottom 0.305: R87.2 56.9,17.02 58.67,18.8 LED78.K
GND79
  Bottom 0.305: R88.2 55.63,14.73 50.8,19.56 LED77.K
GND80
  Bottom 0.305: R89.2 41.15,17.02 42.93,18.8 LED76.K
GND81
  Bottom 0.305: R90.2 39.88,14.73 35.05,19.56 LED75.K
GND82
  Bottom 0.305: R91.2 25.4,17.02 27.18,18.8 LED74.K
GND83
  Bottom 0.305: R92.2 24.13,14.73 19.3,19.56 LED73.K
GND84
  Bottom 0.305: R93.2 9.65,17.02 11.43,18.8 LED72.K
HLT  (via drill 0.35)
  Top 0.305: LED72.A 17.78,23.11 23.37,28.7 84.33,28.7 84.84,29.21 84.84,38.1 91.19,44.45 IC26.17 | IC12.5 52.58,128.78 53.09,128.27 98.55,128.27 101.35,125.48 139.45,125.48 141.99,122.94 v141.99,120.9
  Bottom 0.305: IC26.17 91.19,46.99 94.23,50.04 139.45,50.04 144.02,54.61 144.02,79.5 142.24,81.28 142.24,120.65 v141.99,120.9
IR_4
  Top 0.305: LED23.A 100.33,59.44 98.81,57.91 73.66,57.91 71.88,56.13 71.88,44.7 83.57,33.02 IC26.5
  Bottom 0.305: IC17.6 107.7,64.52 103.63,60.45 LED23.A | IC27.5 118.36,28.96 116.33,26.92 106.93,26.92 105.41,28.45 105.41,32.17 103.79,33.78 85.6,33.78 83.57,31.75 IC26.5
IR_5
  Top 0.305: LED22.A 92.2,59.44 91.19,58.42 73.41,58.42 71.37,56.39 71.37,44.45 81.03,34.8 IC26.4
  Bottom 0.305: IC17.5 105.16,64.52 102.11,61.47 93.22,61.47 LED22.A | IC27.4 115.82,28.96 114.3,27.43 107.19,27.43 105.92,28.7 105.92,32.3 103.93,34.29 83.57,34.29 81.03,31.75 IC26.4
IR_6
  Top 0.305: LED21.A 84.07,59.69 83.31,58.93 73.15,58.93 70.87,56.64 70.87,44.2 78.49,36.58 IC26.3
  Bottom 0.305: IC17.4 102.62,64.52 100.22,62.13 85.75,62.13 LED21.A | IC27.3 113.28,28.96 112.27,27.94 107.44,27.94 106.43,28.96 106.43,32.51 104.14,34.8 81.53,34.8 78.49,31.75 IC26.3
IR_7
  Top 0.305: LED20.A 75.95,59.69 75.69,59.44 72.9,59.44 70.36,56.9 70.36,43.94 75.95,38.35 IC26.2
  Bottom 0.305: IC17.3 100.08,64.52 98.3,62.74 78.23,62.74 LED20.A | IC27.2 110.74,28.96 110.24,28.45 107.7,28.45 106.93,29.21 106.93,32.65 104.28,35.31 79.5,35.31 75.95,31.75 IC26.2
IR_BUS_0
  Top 0.305: IC16.11 130.05,74.68 130.56,75.18 135.89,75.18 136.14,74.93 136.14,61.21 138.18,59.18 JP5.1
  Bottom 0.305: IC18.11 90.68,72.14 93.22,69.6 115.57,69.6 118.62,72.64 118.62,75.18 119.63,76.2 128.52,76.2 130.05,74.68 IC16.11
IR_BUS_1
  Top 0.305: JP5.2 138.18,61.72 136.65,63.25 136.65,75.18 136.14,75.69 128.52,75.69 127.51,74.68 IC16.12
  Bottom 0.305: IC18.12 88.14,72.14 91.19,69.09 117.6,69.09 120.9,72.39 120.9,74.93 121.67,75.69 126.49,75.69 127.51,74.68 IC16.12
IR_BUS_2
  Top 0.305: IC16.13 124.97,74.68 126.49,76.2 136.4,76.2 137.16,75.44 137.16,65.28 138.18,64.26 JP5.3
  Bottom 0.305: IC18.13 85.6,71.88 88.9,68.58 117.86,68.58 121.41,72.14 121.41,74.68 121.92,75.18 124.46,75.18 124.97,74.68 IC16.13
IR_BUS_3
  Top 0.305: JP5.4 138.18,66.8 137.67,67.31 137.67,75.69 136.65,76.71 124.46,76.71 122.43,74.68 IC16.14
  Bottom 0.305: IC18.14 83.06,72.14 87.08,68.12 119.69,68.12 122.43,70.87 IC16.14
IR_BUS_4
  Bottom 0.305: IC18.15 82.3,75.18 91.19,75.18 92.46,73.91 92.46,71.37 93.73,70.1 104.39,70.1 IC17.11 107.7,74.68 109.73,76.71 129.29,76.71 131.06,74.93 131.06,70.87 132.59,69.34 JP5.5
IR_BUS_5
  Bottom 0.305: IC18.16 80.26,75.69 91.44,75.69 92.96,74.17 92.96,71.88 94.23,70.61 102.36,70.61 IC17.12 105.16,74.68 107.7,77.22 129.54,77.22 131.57,75.18 131.57,71.88 132.84,70.61 136.91,70.61 138.18,71.88 JP5.6
IR_BUS_6
  Bottom 0.305: IC18.17 78.23,76.2 91.69,76.2 93.47,74.42 93.47,72.14 94.49,71.12 100.58,71.12 102.62,73.15 IC17.13 102.62,74.68 105.66,77.72 130.56,77.72 133.6,74.68 133.6,71.37 133.86,71.12 136.65,71.12 137.67,72.14 137.67,73.91 138.18,74.42 JP5.7
IR_BUS_7
  Bottom 0.305: IC18.18 72.9,74.68 74.93,76.71 91.95,76.71 93.98,74.68 93.98,72.4 94.75,71.63 99.31,71.63 100.08,72.39 IC17.14 100.08,74.68 103.63,78.23 130.81,78.23 134.11,74.93 134.11,71.88 134.37,71.63 136.14,71.63 136.91,72.39 136.91,75.69 138.18,76.96 JP5.8
MAR_BUS_0
  Top 0.305: IC2.11 129.79,151.13 JP2.1
MAR_BUS_1
  Top 0.305: IC2.12 127.76,150.62 136.65,150.62 138.68,148.59 JP2.2
MAR_BUS_2
  Top 0.305: IC2.13 125.73,150.11 135.89,150.11 139.95,146.05 JP2.3
MAR_BUS_3
  Top 0.305: IC2.14 123.7,149.61 135.38,149.61 137.92,147.07 137.92,145.03 139.45,143.51 JP2.4
N$2
  Top 0.305: IC3.4 118.36,83.06 117.09,81.79 115.57,81.79 114.55,82.8 114.55,85.09 116.08,86.61 124.21,86.61 127.51,89.92 127.51,97.65 126.35,98.81 69.34,98.81 52.83,115.32 U$3.4
N$3
  Top 0.305: IC3.7 125.98,86.11 129.79,89.92 129.79,97.79 127.76,99.82 69.85,99.82 57.91,111.76 U$3.6
N$4
  Top 0.305: IC3.9 128.52,98.04 127.25,99.31 69.6,99.31 56.9,112.01 56.9,121.49 U$3.12
N$5
  Top 0.305: IC3.12 122.94,89.41 126.24,89.41 127,90.17 127,97.03 125.73,98.3 68.58,98.3 57.15,109.73 56.48,109.73 51.82,114.39 51.82,118.69 54.1,120.97 54.1,124.21 54.83,124.94 59.55,124.94 60.45,124.03 U$3.10
N$6
  Bottom 0.305: R6.2 17.53,114.81 LED1.A
N$7
  Bottom 0.305: LED3.A R4.2
N$8
  Bottom 0.305: LED3.K 6.86,97.54 7.87,96.52 S2.3
N$9
  Bottom 0.305: IC1.14 96.52,151.38 92.96,147.83 92.96,141.73 93.73,140.97 93.73,136.4 92.2,134.87 SW2.2
N$10
  Bottom 0.305: IC1.11 102.36,155.45 96.27,155.45 95.25,154.43 95.25,151.64 92.51,148.9 92.51,141.54 93.27,140.78 93.27,136.65 89.66,133.04 SW2.1
N$11
  Bottom 0.305: IC2.6 127.25,147.07 123.7,150.62 109.73,150.62 IC1.10
N$12
  Bottom 0.305: IC1.13 99.06,152.4 101.35,150.11 121.67,150.11 124.71,147.07 IC2.5
N$13
  Bottom 0.305: IC1.6 106.17,148.08 117.35,148.08 118.36,147.07 118.36,144.78 118.87,144.27 120.9,144.27 122.17,145.54 IC2.4
N$14
  Bottom 0.305: IC1.3 96.52,146.81 98.55,148.84 118.36,148.84 119.63,147.57 IC2.3
N$15
  Bottom 0.305: IC1.5 101.6,146.81 100.58,147.83 98.81,147.83 97.79,146.81 97.79,144.27 98.81,143.26 98.81,137.41 98.04,136.65 96.27,136.65 94.74,138.18 SW2.6
N$16
  Bottom 0.305: IC1.2 93.98,145.29 97.28,141.99 SW2.5
N$17
  Bottom 0.305: U$4.3 28.78,113.79 37.59,113.79 38.61,114.81 38.61,116.08 39.62,117.09 48.59,117.09 U$3.3 50.29,112.78 48.77,111.25 IC14.12
N$18
  Bottom 0.305: U$4.5 35.73,118.87 71.88,118.87 73.15,117.6 IC13.3
N$19
  Bottom 0.305: U$4.7 37.34,116.16 39.04,117.86 66.29,117.86 68.07,116.08 IC13.1
N$20
  Bottom 0.305: R2.1 R3.1 26.42,153.16 25.4,153.16 24.38,152.15 IC9.7
N$21
  Bottom 0.305: 20.83,147.32 18.8,147.32 13.72,152.4 R1.E C8.+ | IC9.2 23.37,144.78 20.83,147.32 | 20.83,147.32 25.65,152.15 IC9.6
N$22
  Bottom 0.305: C11.1 31.24,152.15 IC9.5
N$23
  Bottom 0.305: C12.1 IC6.5
N$24
  Bottom 0.305: C13.1 57.66,153.16 IC6.7 IC6.6 62.74,150.62 65.79,150.62 66.29,151.13 66.29,154.94 68.58,157.23 R7.2
N$25
  Bottom 0.305: R5.2 57.91,141.22 58.93,142.24 IC6.2 60.2,145.54 61.98,145.54 62.48,145.03 62.48,143.51 63.25,142.75 69.11,142.75 71.63,145.26 S3.1
N$26
  Bottom 0.305: R8.2 68.07,143.26 63.5,143.26 62.99,143.76 62.99,145.29 62.23,146.05 58.42,146.05 57.66,145.29 57.66,143.26 57.15,142.75 55.37,142.75 55.07,143.05 55.07,143.97 54.77,144.27 IC8.4 45.47,145.54 41.4,145.54 40.39,144.53 40.39,143.51 39.62,142.75 10.41,142.75 7.11,139.45 S4.3
N$27
  Bottom 0.305: IC8.2 41.66,142.75 40.13,141.22 R15.2 37.59,142.24 15.8,142.24 14.73,141.17 S4.1
N$28
  Bottom 0.305: C14.1 IC8.5
N$29
  Top 0.305: IC9.3 24.89,143.51 22.86,143.51 19.3,139.95 19.3,130.81 20.07,130.05 IC10.1
N$30  (via drill 0.35)
  Top 0.305: v29.72,135.64 29.72,133.35 30.99,132.08 IC10.5
  Bottom 0.305: IC6.3 61.47,136.65 60.71,135.89 35.56,135.89 34.8,136.65 34.8,138.94 34.29,139.45 30.48,139.45 29.72,138.68 v29.72,135.64
N$31
  Bottom 0.305: IC12.4 50.04,131.32 48.51,132.84 35.81,132.84 34.54,131.57 34.54,128.78 33.78,128.02 29.72,128.02 28.45,129.29 IC10.4
N$32
  Bottom 0.305: IC12.3 47.5,131.32 46.63,132.18 36.18,132.18 35.1,131.11 35.1,128.57 34.04,127.51 24.64,127.51 23.37,128.78 IC10.2 24.64,131.32 24.64,138.68 25.91,139.95 39.88,139.95 IC8.3
N$33
  Bottom 0.305: IC11.1 64.01,131.83 60.96,134.87 28.96,134.87 25.91,131.83 IC10.3
N$34
  Bottom 0.305: IC11.2 66.55,129.54 65.43,128.42 62.84,128.42 61.98,129.29 61.98,132.33 59.94,134.37 34.29,134.37 33.53,133.6 IC10.6
N$35
  Bottom 0.305: IC11.3 69.09,130.56 64.26,135.38 34.54,135.38 33.53,136.4 IC10.9
N$36  (via drill 0.35)
  Top 0.305: v34.54,133.6 32,133.6 30.99,134.62 IC10.10
  Bottom 0.305: IC12.6 51.56,133.6 v34.54,133.6
N$37
  Bottom 0.305: R1.S R3.2
N$38
  Bottom 0.305: R16.1 75.18,150.11 77.22,152.15 LED2.K
N$39
  Bottom 0.305: U$4.9 39.88,122 41.08,120.8 89.56,120.8 90.68,121.92 IC7.13
N$40
  Bottom 0.305: U$4.11 34.8,121.49 36.15,120.14 92.96,120.14 IC7.11
N$41
  Bottom 0.305: U$3.5 57.32,117.35 63.75,117.35 67.56,113.54 68.33,113.54 69.09,114.3 69.09,116.84 69.85,117.6 71.37,117.6 72.14,116.84 72.14,114.05 72.64,113.54 73.66,113.54 74.17,114.05 74.17,117.35 75.18,118.36 92.71,118.36 94.49,116.59 94.49,114.3 93.73,113.54 92.71,113.54 91.69,114.55 91.69,116.59 91.19,117.09 88.9,117.09 88.14,116.33 IC7.1
N$42
  Bottom 0.305: U$3.7 61.9,116.84 63.5,116.84 67.31,113.03 68.58,113.03 69.6,114.05 69.6,116.59 70.1,117.09 71.12,117.09 71.63,116.59 71.63,113.79 72.39,113.03 73.91,113.03 74.68,113.79 74.68,117.09 75.44,117.86 91.95,117.86 93.22,116.59 IC7.3
N$43
  Top 0.305: U$3.9 66.88,119.13 94.49,119.13 IC7.5
N$44
  Bottom 0.305: U$3.11 57.91,122.25 58.91,121.26 84.84,121.26 85.85,122.28 85.85,123.19 87.88,125.22 99.31,125.22 100.84,123.7 IC7.9
N$45  (via drill 0.35)
  Top 0.305: IC5.2 113.79,113.03 v90.68,113.03 73.41,113.03 LED14.A
  Bottom 0.305: IC7.2 v90.68,113.03
N$46  (via drill 0.35)
  Top 0.305: IC5.3 115.57,112.27 v95.76,112.27 80.52,112.27 LED15.A
  Bottom 0.305: IC7.4 v95.76,112.27
N$47  (via drill 0.35)
  Top 0.305: LED12.A 87.63,111.51 v100.08,111.51 117.35,111.51 IC5.4
  Bottom 0.305: IC7.6 100.84,112.27 v100.08,111.51
N$48  (via drill 0.35)
  Top 0.305: IC5.5 119.13,110.74 v102.36,110.74 94.74,110.74 LED13.A
  Bottom 0.305: IC7.8 102.36,121.92 v102.36,110.74
N$49
  Top 0.305: LED10.A 101.85,109.98 121.41,109.98 126.24,114.81 IC5.6
  Bottom 0.305: IC7.10 101.85,119.38 101.85,111.76 99.06,108.97 LED10.A
N$50
  Top 0.305: IC5.7 122.68,109.22 108.97,109.22 LED11.A
  Bottom 0.305: IC7.12 95,124.71 96.27,124.71 97.03,123.95 97.03,121.41 99.57,118.87 99.57,113.79 97.79,112.01 97.79,106.68 98.55,105.92 100.84,105.92 103.63,108.71 105.41,108.71 LED11.A
N$51  (via drill 0.35)
  Top 0.305: LED8.A 116.08,108.46 124.46,108.46 IC5.8 | v78.49,104.65 v113.03,104.65
  Bottom 0.305: IC13.2 71.17,114.76 71.17,113.6 72.2,112.57 73.36,112.57 77.22,108.71 77.22,105.92 v78.49,104.65 | v113.03,104.65 114.81,106.43 LED8.A
N$52  (via drill 0.35)
  Top 0.305: IC5.9 125.73,107.19 LED9.A 120.9,105.66 v86.36,105.66
  Bottom 0.305: v86.36,105.66 83.31,108.71 82.3,108.71 IC13.4
N$53
  Bottom 0.305: IC14.14 41.91,105.92 40.64,105.92 39.88,106.68 39.88,108.97 39.12,109.73 35.05,109.73 33.78,108.46 S1.3
N$54
  Bottom 0.305: IC14.13 46.23,104.65 44.96,103.38 44.96,97.28 42.67,95 42.67,88.14 IC15.3
N$55
  Bottom 0.305: IC15.1 36.58,81.53 53.09,81.53 R23.2 59.44,87.88 C4.2
N$56
  Bottom 0.305: SW3.9 68.33,87.12 112.27,87.12 113.28,86.11 IC3.2
N$57
  Bottom 0.305: SW3.10 70.36,86.61 111.51,86.61 112.01,86.11 112.01,82.8 112.72,82.09 119.38,82.09 120.9,83.62 IC3.5
N$58
  Bottom 0.305: SW3.5 72.64,89.92 74.17,88.39 122.43,88.39 123.44,89.41 IC3.11
N$59
  Bottom 0.305: SW3.6 70.1,89.92 72.14,87.88 122.68,87.88 124.71,89.92 124.71,92.71 123.95,93.47 122.94,93.47 122.17,92.71 122.17,90.42 120.9,89.15 118.11,89.15 IC3.14
N$60
  Bottom 0.305: SW3.2 82.8,88.9 92.46,88.9 93.22,89.66 IC4.14
N$61
  Bottom 0.305: SW3.14 79.5,85.6 88.14,85.6 89.41,84.33 89.41,82.55 90.17,81.79 97.79,81.79 98.3,82.3 IC4.5
N$62
  Bottom 0.305: SW3.1 82.8,90.68 84.07,89.41 90.93,89.41 91.95,90.42 91.95,92.46 92.46,92.96 100.08,92.96 100.84,92.2 IC4.11
N$63
  Bottom 0.305: SW3.13 77.47,86.11 89.41,86.11 90.68,84.84 IC4.2
N$64
  Top 0.305: IC4.9 105.92,92.71 104.9,93.73 64.12,93.73 57.4,100.44 57.4,102.62 55.88,104.14 48.77,104.14 47.24,105.66 47.24,109.22 46.23,110.24 31.07,110.24 29.72,111.59 U$4.4
N$65  (via drill 0.35)
  Top 0.305: IC4.4 97.79,81.53 100.84,81.53 101.85,82.55 101.85,86.11 103.12,87.38 105.41,87.38 107.95,89.92 107.95,92.96 106.17,94.74 65.02,94.74 58.37,101.4 58.37,102.94 56.16,105.16 50.55,105.16 49.78,105.92 49.78,109.22 48.77,110.24 v48.77,121.67
  Bottom 0.305: v48.77,121.67 48.77,123.95 48.26,124.46 39.12,124.46 38.61,123.95 38.61,122.17 37.85,121.41 36.83,121.41 36.07,122.17 36.07,123.95 35.56,124.46 33.19,124.46 32.26,123.52 U$4.12
N$66  (via drill 0.35)
  Top 0.305: IC4.7 103.38,85.85 104.14,86.61 106.43,86.61 108.46,88.65 108.46,93.22 106.43,95.25 65.28,95.25 58.93,101.6 58.93,103.12 56.39,105.66 50.8,105.66 50.29,106.17 50.29,109.22 51.31,110.24 v51.31,121.67
  Bottom 0.305: v51.31,121.67 51.31,124.21 50.55,124.97 38.1,124.97 37.34,124.21 U$4.10
N$67
  Top 0.305: IC4.12 100.33,89.15 106.43,89.15 107.19,89.92 107.19,92.71 105.66,94.23 64.77,94.23 57.86,101.14 57.86,102.81 56.02,104.65 49.02,104.65 47.75,105.92 47.75,109.36 46.37,110.74 36.15,110.74 34.8,112.09 U$4.6
N$68
  Top 0.305: LED19.A 129.79,63.5 89.15,63.5 88.14,64.52 IC18.9
  Bottom 0.305: IC16.6 130.05,63.25 LED19.A
N$69
  Top 0.305: IC18.8 85.6,64.52 87.12,62.99 122.17,62.99 LED18.A
  Bottom 0.305: IC16.5 127.51,63.25 LED18.A
N$70
  Top 0.305: IC18.7 83.06,64.52 85.09,62.48 114.55,62.48 LED17.A
  Bottom 0.305: IC16.4 124.97,64.77 120.65,60.45 LED17.A
N$71
  Top 0.305: IC18.6 80.52,64.52 83.06,61.98 106.93,61.98 LED16.A
  Bottom 0.305: IC16.3 122.43,64.52 119.89,61.98 109.98,61.98 LED16.A
N$129
  Bottom 0.305: IC40.1 16.26,73.91 16.76,74.42 28.45,74.42 28.96,73.91 IC40.6
N$130
  Bottom 0.305: U1.1 8.64,34.29 6.86,36.07 6.86,66.04 10.41,69.6 19.56,69.6 21.34,71.37 IC40.3
N$131
  Bottom 0.305: S7.1 9.68,75.39 9.68,76.99 9.65,76.96 8.89,77.72 8.89,80.77 10.67,82.55 R77.1 17.53,82.55 18.8,81.28 IC40.13 IC40.12
N$132
  Top 0.305: IC28.3 37.85,3.81 39.12,5.08 39.12,14.22 37.85,15.49 37.85,22.86 LED75.A 41.66,27.18 88.65,27.18 89.66,28.19 89.66,31.5 89.71,31.55 89.71,35.24 98.81,44.34 IC26.14
N$133
  Top 0.305: IC28.5 42.93,3.81 44.2,5.08 44.2,16.26 45.47,17.53 LED76.A 49.02,26.67 88.9,26.67 90.17,27.94 90.17,33.27 101.35,44.45 IC26.13
N$134
  Top 0.305: IC26.11 98.81,31.75 97.79,32.77 93.22,32.77 92.2,31.75 92.2,28.19 90.17,26.16 56.39,26.16 LED77.A 53.34,19.05 45.47,11.18 IC28.9
N$135  (via drill 0.35)
  Top 0.305: LED78.A 63.75,25.65 90.42,25.65 92.76,27.99 92.76,31.54 93.48,32.26 95.76,32.26 96.27,31.75 IC26.10 | IC28.11 40.39,15.49 v44.45,19.56
  Bottom 0.305: v44.45,19.56 49.02,24.13 60.2,24.13 LED78.A
N$136  (via drill 0.35)
  Top 0.305: LED79.A 71.12,25.15 90.68,25.15 93.73,28.19 IC26.9 | IC28.13 35.31,17.53 v37.08,19.3
  Bottom 0.305: v37.08,19.3 42.42,24.64 67.56,24.64 LED79.A
N$137
  Top 0.305: 78.23,23.11 89.15,12.19 97.28,12.19 98.04,11.43 98.04,4.83 97.03,3.81 IC39.1 | IC27.17 125.98,44.2 122.43,40.64 122.43,28.45 121.16,27.18 93.47,27.18 90.93,24.64 79.76,24.64 78.23,23.11 | 78.23,23.11 LED80.A
N$138
  Top 0.305: IC27.15 131.06,44.2 124.97,38.1 124.97,27.18 123.95,26.16 100.84,26.16 98.81,24.13 93.73,24.13 LED82.A 92.71,13.97 93.98,12.7 97.54,12.7 98.55,11.68 98.55,4.83 98.81,4.57 101.35,4.57 102.11,3.81 IC39.3
N$139
  Top 0.305: IC39.5 107.19,4.83 108.71,6.35 108.71,11.18 116.33,18.8 LED85.A 116.33,23.62 116.84,24.13 125.73,24.13 129.79,28.19 129.79,31.5 130.3,32 132.84,32 133.6,31.24 IC27.11
N$140
  Top 0.305: IC39.9 109.73,11.43 117.09,18.8 121.67,18.8 124.21,21.34 LED86.A 124.21,23.37 124.46,23.62 126.49,23.62 131.06,28.19 IC27.10
N$141
  Top 0.305: IC39.11 104.65,11.18 105.41,11.94 108.71,11.94 115.32,18.54 115.32,23.62 116.33,24.64 124.97,24.64 128.52,28.19 IC27.9 128.52,31.5 129.54,32.51 133.6,32.51 134.87,31.24 134.87,26.67 131.83,23.62 LED87.A
N$142
  Bottom 0.305: R95.1 42.93,56.64 46.99,60.71 LED69.A
N$143
  Bottom 0.305: R94.1 56.9,58.67 54.86,60.71 LED68.A
N$144
  Bottom 0.305: R96.1 41.15,58.67 39.12,60.71 LED70.A
N$145
  Bottom 0.305: R98.1 58.42,56.64 62.74,60.96 LED67.A
N$146
  Bottom 0.305: R97.1 26.92,56.64 31.24,60.96 LED71.A
N_AI
  Bottom 0.305: IC28.10 42.93,8.89 43.94,7.87 130.81,7.87 132.08,9.14 135.14,9.14 138.5,12.5 140,12.5 JP1.10
N_AO
  Bottom 0.305: IC28.12 37.85,8.64 39.12,7.37 131.32,7.37 132.33,8.38 135.89,8.38 JP1.11
N_BI
  Bottom 0.305: IC39.4 104.65,3.81 105.66,4.83 135.89,4.83 138.94,7.87 JP1.13
N_CLK
  Top 0.305: IC12.2 44.96,129.79 42.16,127 18.03,127 11.18,120.14 11.18,106.43 8.13,103.38 8.13,100.84 9.65,99.31 9.65,83.57 8.64,82.55 8.64,68.83 6.3,66.5 6.3,41.86 2.29,37.85 2.29,30.23 4.06,28.45 10.16,28.45 11.18,29.46 U1.2
N_CLR  (via drill 0.35)
  Top 0.305: IC40.4 IC40.11 IC40.10 IC40.9 40.64,68.58 132.84,68.58 133.6,67.82 133.6,63.25 134.87,61.98 134.87,57.66 v136.65,55.88 | v137.41,52.07 137.41,48.77 138.18,48.01 138.18,26.42 131.06,19.3 v131.06,11.18 | v134.87,11.18 136.4,11.18 138.12,12.9 139.63,12.9 140.26,13.53 140.26,16.05 140.72,16.51 JP1.8
  Bottom 0.305: v136.65,55.88 137.41,55.12 v137.41,52.07 | v131.06,11.18 v134.87,11.18
N_CO
  Bottom 0.305: IC39.6 109.73,4.06 109.98,4.32 136.14,4.32 140.72,8.89 JP1.14
N_EO
  Bottom 0.305: IC39.2 99.57,3.81 101.09,5.33 135.38,5.33 137.67,7.62 137.67,9.4 138.43,10.16 140.97,10.16 141.48,10.67 JP1.12
N_FI
  Bottom 0.305: IC39.10 108.97,11.94 135.89,11.94 137.67,13.72 137.67,16 138.18,16.51 JP1.7
N_II  (via drill 0.35)
  Top 0.305: IC16.9 IC16.10 130.05,70.87 | 130.05,70.87 115.32,70.87 IC17.9 IC17.10 | 130.05,70.87 132.59,70.87 134.11,69.34 134.11,64.52 135.38,63.25 135.38,59.44 v137.67,57.15 | v138.18,52.83 138.18,48.77 138.68,48.26 138.68,26.16 131.83,19.3 131.83,9.91 v131.06,9.14
  Bottom 0.305: IC28.8 48.01,8.64 48.26,8.38 130.3,8.38 v131.06,9.14 | v137.67,57.15 138.18,56.64 v138.18,52.83
N_IO  (via drill 0.35)
  Top 0.305: IC18.19 72.14,71.63 91.44,71.63 92.46,72.64 92.46,74.17 96.01,77.72 134.62,77.72 137.87,80.97 142.04,80.97 143,80.01 143,55.37 v142.24,54.61 | v141.22,52.83 141.22,28.45 143.76,25.91 143.76,21.34 142.75,20.32 135.89,20.32 134.11,18.54 v134.11,6.86
  Bottom 0.305: IC28.6 45.47,3.81 47.5,5.84 133.1,5.84 v134.11,6.86 | v142.24,54.61 142.24,54.36 141.22,53.34 v141.22,52.83
N_J
  Bottom 0.305: JP1.9 135.13,10.16 IC39.8
N_MI  (via drill 0.35)
  Top 0.305: v133.35,7.62 133.35,19.05 137.16,22.86 141.99,22.86 143,23.88 143,25.65 140.46,28.19 v140.46,52.07
  Bottom 0.305: IC28.2 35.31,3.56 38.61,6.86 131.57,6.86 132.33,7.62 v133.35,7.62 | IC2.10 IC2.9 132.59,153.67 136.14,150.11 136.14,126.24 138.68,123.7 138.68,111.25 135.64,108.2 135.64,80.77 136.65,79.76 141.22,79.76 143.51,77.47 143.51,57.15 140.46,54.1 v140.46,52.07
N_RO  (via drill 0.35)
  Top 0.305: v139.7,52.83 139.7,26.42 132.59,19.3 v132.59,6.86
  Bottom 0.305: IC28.4 40.39,3.81 42.93,6.35 132.08,6.35 v132.59,6.86 | v139.7,52.83 139.7,54.1 143,57.4 143,77.22 140.97,79.25 136.14,79.25 134.62,80.77 134.62,108.71 137.92,112.01 137.92,117.86 136.14,119.63 118.11,119.63 116.08,121.67 IC5.19
OI
  Top 0.305: LED83.A 101.6,24.13 106.68,24.13 108.2,25.65 124.2,25.65 127,28.45 127,37.48 133.6,44.08 IC27.14
  Bottom 0.305: IC27.14 133.6,38.86 137.67,34.8 137.67,23.88 138.68,22.86 141.22,22.86 141.48,22.61 JP1.4
PROG
  Top 0.305: IC14.1 38.61,98.3 40.64,96.27 55.37,96.27 64.26,87.38 84.33,87.38 IC4.1 | IC1.1 91.44,144.02 79.25,131.83 49.53,131.83 48.77,131.06 48.77,129.03 46.02,126.29 19.61,126.29 14.99,121.67 LED1.K
  Bottom 0.305: LED1.K 16.26,119.89 18.03,119.89 19.05,118.87 19.05,102.11 15.49,98.55 S2.1 34.8,95 38.61,98.81 IC14.1 | IC4.1 88.14,82.3 89.15,81.28 103.38,81.28 104.65,82.55 104.65,84.84 105.16,85.34 110.24,85.34 110.74,84.84 IC3.1
QWER1
  Top 0.305: IC28.1 32.77,3.81 33.78,4.83 33.78,11.94 32.51,13.21 30.73,13.21 21.84,22.1 LED73.A 21.84,23.37 26.67,28.19 86.11,28.19 87.12,29.21 87.12,31.5 87.17,31.55 87.17,37.78 93.73,44.34 IC26.16
RAM_BUS_0
  Top 0.305: IC4.10 103.38,91.95 102.36,92.96 95.25,92.96 94.23,91.95 94.23,89.41 89.66,84.84 89.66,81.28 92.46,78.49 130.56,78.49 134.37,82.3 JP3.1 141.48,82.3 145.29,86.11 145.29,115.57 137.92,122.94 IC5.11
RAM_BUS_1
  Top 0.305: IC4.13 95.76,88.9 91.69,84.84 91.69,81.03 93.73,78.99 130.3,78.99 136.14,84.84 JP3.2 141.48,84.84 144.78,88.14 144.78,115.38 139.56,120.6 136.19,120.6 IC5.12
RAM_BUS_2
  Top 0.305: IC5.13 134.11,120.14 139.37,120.14 144.27,115.24 144.27,90.17 141.48,87.38 JP3.3 139.63,87.3 137.85,87.3 130.05,79.5 93.98,79.5 92.2,81.28 92.2,84.58 92.96,85.34 99.06,85.34 IC4.6
RAM_BUS_3
  Top 0.305: IC4.3 93.22,82.3 95.5,80.01 129.68,80.01 134.87,85.2 134.87,85.85 138.94,89.92 JP3.4 141.48,89.92 143.76,92.2 143.76,115.1 139.18,119.69 132.03,119.69 IC5.14
RAM_BUS_4
  Top 0.305: IC3.10 125.98,92.2 124.46,93.73 112.89,93.73 111.81,92.64 111.81,81.85 113.14,80.52 129.54,80.52 134.11,85.09 134.11,87.63 138.94,92.46 JP3.5 141.48,92.46 143.26,94.23 143.26,114.96 138.99,119.23 129.95,119.23 IC5.15
RAM_BUS_5
  Top 0.305: IC3.13 118.36,92.2 117.35,93.22 113.03,93.22 112.27,92.46 112.27,82.04 113.28,81.03 129.29,81.03 133.35,85.09 133.35,89.66 138.68,95 JP3.6 141.48,95 142.75,96.27 142.75,114.83 138.8,118.77 127.86,118.77 IC5.16
RAM_BUS_6
  Top 0.305: IC5.17 125.78,118.31 138.61,118.31 142.24,114.69 142.24,99.31 141.73,98.81 JP3.7 138.94,97.54 132.59,91.19 132.59,85.09 129.03,81.53 124.83,81.53 123.44,82.92 IC3.6
RAM_BUS_7
  Top 0.305: IC5.18 123.7,117.86 138.42,117.86 141.73,114.55 141.73,100.33 141.48,100.08 JP3.8 138.94,100.08 131.83,92.96 131.83,85.09 128.78,82.04 125.73,82.04 124.71,83.06 124.71,85.09 123.95,85.85 117.35,85.85 115.82,84.33 IC3.3
RI  (via drill 0.35)
  Top 0.305: LED74.A 29.72,23.37 34.04,27.69 86.36,27.69 87.63,28.96 87.63,35.81 96.27,44.45 IC26.15 | IC15.2 36.32,83.06 38.61,80.77 80.01,80.77 v81.28,79.5 | v138.94,52.07 v138.94,49.28
  Bottom 0.305: IC26.15 96.27,46.99 98.55,49.28 v138.94,49.28 | v138.94,52.07 138.94,54.61 142.49,58.17 142.49,76.96 140.72,78.74 82.04,78.74 v81.28,79.5
SU
  Top 0.305: LED81.A 85.85,24.13 91.19,24.13 93.73,26.67 123.7,26.67 124.46,27.43 124.46,40.13 128.52,44.2 IC27.16
  Bottom 0.305: IC27.16 128.52,42.42 137.16,33.78 137.16,23.37 JP1.3
VCC  (via drill 0.35)
  Top 0.508: R2.2 20.83,154.69 IC9.8 IC9.4 | 36.32,151.89 36.07,151.64 | 34.04,149.61 C9.1 | 51.31,149.35 C10.1 52.58,149.35 | 55.12,151.89 54.86,151.64 | 64.01,144.53 IC6.4 IC11.14 | R8.1 71.88,153.67 87.38,153.67 C2.1 IC1.16 | R15.1 36.07,141.22 39.62,137.67 IC12.14 43.43,138.68 43.43,140.21 44.45,141.22 R5.1 | R6.1 14.99,102.87 12.45,105.41 | 12.45,105.41 9.4,102.36 R4.1 | 12.45,105.41 12.45,114.55 16.26,118.36 16.26,120.65 17.35,121.75 20.83,121.75 | 20.83,89.66 C1.1 28.96,89.66 31.24,91.95 IC15.14 33.78,98.3 38.61,103.12 IC14.16 38.61,103.38 39.88,102.11 39.88,98.81 41.4,97.28 56.51,97.28 65.39,88.39 85.34,88.39 IC4.16 | U$4.16 22.1,124.03 22.78,124.71 30.23,124.71 30.99,123.95 30.99,121.92 31.75,121.16 43.35,121.16 U$3.16 45.21,124.46 46.48,125.73 66.29,125.73 68.07,123.95 IC13.14 70.36,120.65 85.85,120.65 IC7.14 90.68,120.4 95.5,120.4 98.04,117.86 C3.1 109.73,115.32 IC5.1 IC5.20 113.54,117.35 113.59,117.3 134.42,117.3 135.13,116.59 135.13,114.3 v132.59,111.76 | IC3.16 110.74,92.96 113.03,95.25 v124.71,95.25 | IC16.16 115.06,75.69 97.28,75.69 IC17.16 | R94.2 48.51,58.17 49.02,57.66 50.55,57.66 50.8,57.4 R95.2 | R95.2 52.58,54.86 57.15,54.86 | R96.2 32.77,57.91 33.02,57.66 34.8,57.66 35.05,57.4 R97.2 36.83,54.86 49.02,54.86 R95.2 | S7.3 13.44,80.26 IC40.14 16.26,83.06 20.83,83.06 | IC28.14 32.77,10.92 31.5,12.19 14.99,12.19 12.7,14.48 12.7,23.37 17.53,28.19 21.84,28.19 23.88,30.23 U1.7 23.88,32 21.34,34.54 | C20.1 6.6,38.35 U1.16 8.64,37.34 11.43,34.54 21.34,34.54 | IC26.24 73.41,46.99 73.91,47.5 80.26,47.5 81.03,46.74 | 81.03,46.74 IC26.21 | 81.03,46.74 81.28,46.74 82.04,47.5 107.19,47.5 108.2,46.48 IC27.24 108.2,44.45 112.01,40.64
  Top 0.508: 112.01,40.64 115.82,44.45 IC27.21 | 112.01,40.64 112.01,35.31 108.2,31.5 IC27.1 | 46.99,32.26 45.21,34.04 37.34,34.04 34.29,37.08 IC25.16 U1.9 U1.10 23.88,37.08 21.34,34.54
  Top 1.016: 114.55,154.69 116.59,156.72 134.62,156.72 137.67,153.67 141.99,153.67 143.76,151.89 143.76,143.26 139.19,138.68 JP6.2 JP6.1 | IC2.16 114.55,154.69 | 114.55,154.69 114.55,154.94 112.52,156.97 92.46,156.97 91.44,155.96 IC1.16 87.38,153.67 | C2.1 71.88,153.67 71.88,150.11 R7.1 66.55,147.07 64.01,144.53 64.01,144.18 56.39,151.8 IC6.8 55.12,151.89 | 54.86,151.64 52.58,149.35 51.31,149.35 | C10.1 41.57,149.35 39.12,151.8 IC8.8 36.32,151.89 | 36.07,151.64 34.04,149.61 | C9.1 32.26,149.35 30.99,148.08 30.99,145.8 29.72,144.53 IC9.4 R15.1 22.86,141.22 20.83,139.19 IC10.14 | U$4.16 20.83,121.75 20.83,89.66 20.83,83.06 32,83.06 43.18,71.88 66.29,71.88 IC18.20 70.87,70.36 91.95,70.36 IC17.16 | IC18.1 67.82,62.99 C5.1 R98.2 63.25,56.64 61.47,54.86 57.15,54.86 57.15,35.81 | IC25.6 46.99,32.26 48.77,34.04 55.37,34.04 57.15,35.81 | C15.1 57.15,35.81
  Bottom 0.508: v132.59,111.76 132.33,111.51 132.33,99.82 127.76,95.25 v124.71,95.25 | IC28.14 34.8,12.19 96.01,12.19 97.03,11.18 IC39.14 | IC26.24 70.1,45.72 66.55,49.28 R98.2 | 19.05,126.06 19.22,125.9
  Bottom 1.016: IC10.14 19.05,135.89 19.05,126.06 | 19.22,125.9 U$4.16 | IC18.20 IC18.1
ZF  (via drill 0.35)
  Top 0.305: IC27.22 113.28,46.74 114.05,47.5 136.4,47.5 137.16,46.74 137.16,26.92 129.03,18.8 129.03,14.22 v129.79,13.46
  Bottom 0.305: IC27.22 113.28,46.74 112.78,47.24 109.98,47.24 109.47,46.74 109.47,44.45 106.68,41.66 81.28,41.66 78.49,44.45 IC26.22 | v129.79,13.46 130.81,12.45 135.38,12.45 137.16,14.22 137.16,17.02 137.92,17.78 140.46,17.78 141.6,18.92 JP1.6

## Text on the board
tPlace: CLOCK | MEMORY ADDRESS | RAM | RUN | PROG | RESET | INSTRUCTION REGISTER | CONTROL WORD
tNames: T0 | T1 | T2 | T3 | T4 | HLT | MI | RI | RO | IO | II | AI | AO | EO | SU | BI | OI | CE | CO | CI | FI